# Altium project Left Eye Module.PrjPcb
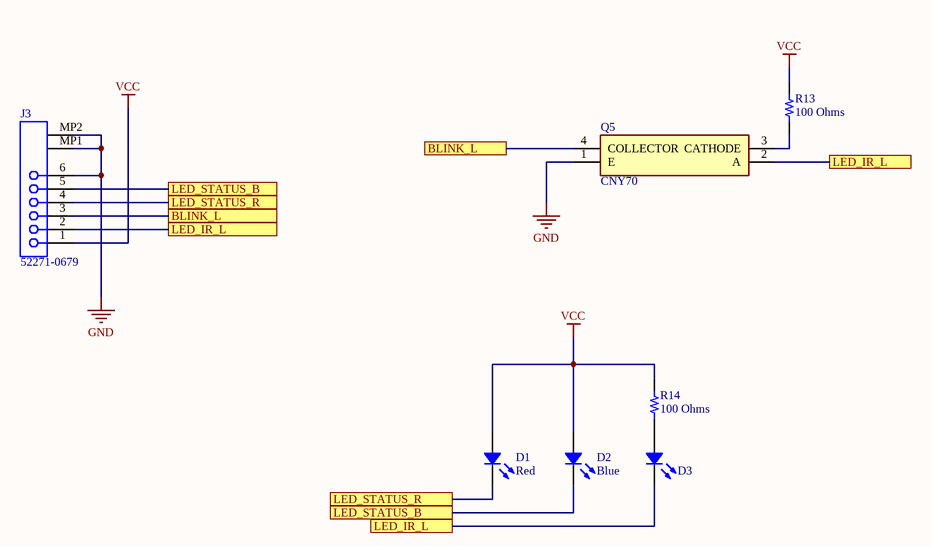
[diagram p0: Left Eye Module.SchDoc]
1 sheet, 7 parts. Net scope: flat (ports and power ports of the same name join across sheets).
Board file: Left Eye Module.PcbDoc

## Sheet Left Eye Module.SchDoc
size A

### Parts
D1  Red  [LED 1206_3216 RED]
D2  Blue  [LED 1206_3216 BLUE]
D3  (no value)  [OP269A]
J3  52271-0679  [MOLX-52271-0679]
Q5  CNY70  [CNY70]
R13  100 Ohms  [RES 0603_1608]
R14  100 Ohms  [RES 0603_1608]

### Ports
BLINK_L, LED_IR_L, LED_STATUS_B, LED_STATUS_R

### Nets
GND: J3.6 J3.MP1 J3.MP2 Q5.1(E)
VCC: D1.1 D2.1 J3.1 R13.2 R14.2
BLINK_L: J3.3 Q5.4(COLLECTOR) ; port BLINK_L
LED_IR_L: D3.2 J3.2 Q5.2(A) ; port LED_IR_L
LED_STATUS_B: D2.2 J3.5 ; port LED_STATUS_B
LED_STATUS_R: D1.2 J3.4 ; port LED_STATUS_R
NetD3_1: D3.1 R14.1
NetQ5_3: Q5.3(CATHODE) R13.1

### Library data of the parts
D1 = SML-LX1206IW-TR: LED RED DIFFUSED 1206 SMD; Manufacturer: Lumex Opto/Components Inc.; Configuration: Standard; Current - Test: 20mA; Lens Color: White; Lens Size: 2.00mm x 1.60mm; Lens Style: Rectangle with Flat Top; Millicandela Rating: 6mcd; Viewing Angle: 160°; Voltage - Forward (Vf) (Typ): 2V; Wavelength - Peak: 635nm; Part Number: SML-LX1206IW-TR; Color: Red; ComponentLink1Description: Datasheet; ComponentLink1URL: https://www.lumex.com/content/files/ProductAttachment/SML-LX1206IW-TR.pdf; ComponentLink2Description: DigiKey Link; ComponentLink2URL: http://digikey.com/product-detail/en/lumex-opto-components-inc/SML-LX1206IW-TR/67-1003-1-ND/270801; Device Package: 1206 (3216 Metric); Height (Max): 1.10mm; LastUpdated: 1/21/2020 3:14:28 AM; Lens Transparency: Diffused; Lifecycle Status: Active; Minimum Order: 1; Mounting Type: Surface Mount; Package / Case: 1206 (3216 Metric); Packaging: TapeAndReel; PartId: 192; Part Status: Active; Price: 0.08; Series: -; Size / Dimension: 3.20mm L x 1.60mm W; Supplier 1: DigiKey; Supplier Part Number 1: 67-1003-1-ND; Supplier Device Package: 1206; Value: Red
D2 = IN-S126ATB: LED BLUE CLEAR 1206 SMD; Manufacturer: Inolux; Configuration: Standard; Current - Test: 20mA; Lens Size: 2.00mm x 1.50mm; Lens Style: Rectangle with Flat Top; Millicandela Rating: 140mcd; Viewing Angle: 120°; Voltage - Forward (Vf) (Typ): 3.2V; Wavelength - Dominant: 468nm; Wavelength - Peak: 472nm; Part Number: IN-S126ATB; Color: Blue; ComponentLink1Description: Datasheet; ComponentLink1URL: http://www.inolux-corp.com/datasheet/SMDLED/Mono%20Color%20Top%20View/IN-S126AT%20Series_V1.0.pdf; ComponentLink2Description: DigiKey Link; ComponentLink2URL: http://digikey.com/product-detail/en/inolux/IN-S126ATB/1830-1088-1-ND/7604680; Device Package: 1206 (3216 Metric); Height (Max): 1.10mm; LastUpdated: 1/21/2020 3:11:27 AM; Lens Color: Clear; Lens Transparency: Clear; Lifecycle Status: Active; Minimum Order: 1; Mounting Type: Surface Mount; Package / Case: 1206 (3216 Metric); Packaging: TapeAndReel; PartId: 723; Part Status: Active; Price: 0.07; Series: IN-S126AT; Size / Dimension: 3.20mm L x 1.50mm W; Supplier 1: DigiKey; Supplier Part Number 1: 1830-1088-1-ND; Supplier Device Package: 1206; Value: Blue
D3 = LED: Chip LED
J3 = 52271-0679: 1.0 mm Pitch Easy-On(TM) Type FPC Connector, 3.0 mm Mated Height, Right Angle, ZIF, SMT, Bottom Contact, 6 Circuits, -40 to 85 degC, ELV and RoHS Compliant, Tape and Reel; Manufacturer: Molex; Circuits (Loaded): 6; Current (Max per Contact): 0.5A; Durability (mating cycles max): 30; Entry Angle: 90degrees Angle; Mated Height: 3.00mm; Material - Metal: Phosphor Bronze; Material - Plating Mating: Tin-Bismuth; PCB Locator: No; PCB Retention: Yes; Pitch - Mating Interface: 1.00mm; Voltage (Max): 50V AC (RMS)/DC; PackageVersion: Rev. B, 04/2004; PackageReference: 52271-0679; PackageDescription: 6-Lead FPC Connector, Pitch 1.0 mm; Supplier 1: Farnell; Supplier Part Number 1: 1079950; Supplier 2: Newark; Supplier Part Number 2: 58J9529; Supplier 3: Mouser; Supplier Part Number 3: 538-52271-0679; Contact Position: Bottom; Material - Plating Termination: Tin-Bismuth; Number of Rows: 1; Orientation: Right Angle; Packing: Tape and Reel; Pitch - Termination Interface: 1.00mm; Polarized to PCB: Yes; RoHS: TRUE; Stackable: No; Mounting Technology: Surface Mount; PartNumber: 52271-0679; ComponentLink1Description: Manufacturer URL; ComponentLink1URL: http://www.molex.com/molex/index.jsp; ComponentLink2Description: Datasheet; ComponentLink2URL: http://www.molex.com/webdocs/datasheets/pdf/en-us/0522710679_FFC_FPC_CONNECTORS.pdf; ComponentLink3Description: Package Specification; ComponentLink3URL: http://www.molex.com/pdm_docs/sd/522710679_sd.pdf; System: Connector
Q5 = CNY70: Transistor; Manufacturer_Name: Vishay; Datasheet Link: https://componentsearchengine.com//CNY70.pdf; Mouser2 Part Number: 782-CNY70; Mouser2 Price/Stock: https://www.mouser.com/Search/Refine.aspx?Keyword=782-CNY70; Manufacturer_Part_Number: CNY70
R13 R14 = RMCF0603FG100R: RES 100 OHM 1% 1/10W 0603; Manufacturer: Stackpole Electronics Inc; Power (Watts): 0.1W, 1/10W; Temperature Coefficient: ±100ppm/°C; Part Number: RMCF0603FG100R; Value: 100 Ohms; ComponentLink1Description: Datasheet; ComponentLink1URL: https://www.seielect.com/catalog/sei-rmcf_rmcp.pdf; ComponentLink2Description: DigiKey Link; ComponentLink2URL: http://digikey.com/product-detail/en/stackpole-electronics-inc/RMCF0603FG100R/RMCF0603FG100RCT-ND/4425033; Composition: Thick Film; Device Package: 0603 (1608 Metric); Features: Automotive AEC-Q200; Height - Seated (Max): 0.022" (0.55mm); LastUpdated: 1/21/2020 12:16:25 AM; Lifecycle Status: Active; Minimum Order: 1; Number of Terminations: 2; Operating Temperature: -55°C ~ 155°C; Package / Case: 0603 (1608 Metric); Packaging: CutTape; PartId: 24036; Part Status: Active; Price: 0.10; Ratings: AEC-Q200; Resistance: 100 Ohms; Series: RMCF; Size / Dimension: 0.061" L x 0.031" W (1.55mm x 0.80mm); Supplier 1: DigiKey; Supplier Part Number 1: RMCF0603FG100RCT-ND; Supplier Device Package: 0603; Tolerance: ±1%